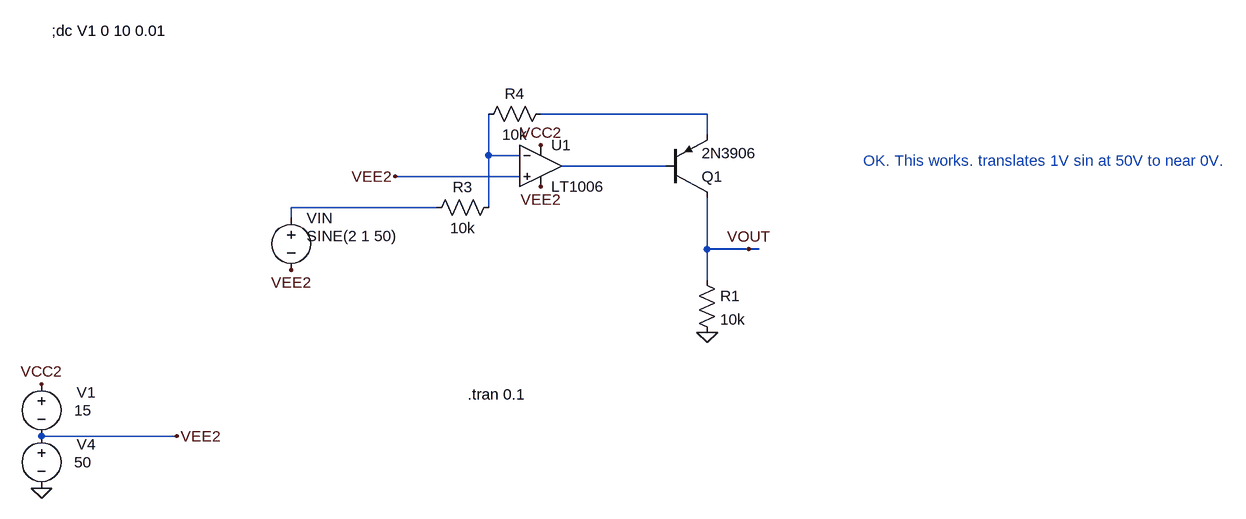
[diagram p0: schematic Draft14.asc]
Draft14.asc, the LTspice schematic file:
Version 4
SHEET 1 1536 680
WIRE 672 16 416 16
WIRE 672 48 672 16
WIRE 336 80 336 16
WIRE 384 80 336 80
WIRE 608 96 448 96
WIRE 384 112 192 112
WIRE 256 160 32 160
WIRE 336 160 336 80
WIRE 32 176 32 160
WIRE 672 224 672 144
WIRE 736 224 672 224
WIRE 752 224 736 224
WIRE 672 272 672 224
WIRE -144 512 -352 512
FLAG -352 592 0
FLAG -144 512 VEE2
FLAG -352 432 VCC2
FLAG 672 352 0
FLAG 416 128 VEE2
FLAG 416 64 VCC2
FLAG 32 256 VEE2
FLAG 192 112 VEE2
FLAG 736 224 VOUT
SYMBOL voltage 32 160 R0
WINDOW 123 0 0 Left 0
WINDOW 39 0 0 Left 0
WINDOW 3 24 44 Left 2
SYMATTR Value SINE(2 1 50)
SYMATTR InstName VIN
SYMBOL voltage -352 496 R0
WINDOW 0 54 29 Left 2
WINDOW 3 50 56 Left 2
WINDOW 123 0 0 Left 0
WINDOW 39 0 0 Left 0
SYMATTR InstName V4
SYMATTR Value 50
SYMBOL pnp 608 144 M180
SYMATTR InstName Q1
SYMATTR Value 2N3906
SYMBOL voltage -352 416 R0
WINDOW 0 54 29 Left 2
WINDOW 3 50 56 Left 2
WINDOW 123 0 0 Left 0
WINDOW 39 0 0 Left 0
SYMATTR InstName V1
SYMATTR Value 15
SYMBOL res 656 256 R0
SYMATTR InstName R1
SYMATTR Value 10k
SYMBOL OpAmps\\LT1006 416 32 R0
SYMATTR InstName U1
SYMBOL res 352 144 R90
WINDOW 0 0 56 VBottom 2
WINDOW 3 32 56 VTop 2
SYMATTR InstName R3
SYMATTR Value 10k
SYMBOL res 432 0 R90
WINDOW 0 0 56 VBottom 2
WINDOW 3 32 56 VTop 2
SYMATTR InstName R4
SYMATTR Value 10k
TEXT -336 -112 Left 2 !;dc V1 0 10 0.01
TEXT 304 448 Left 2 !.tran 0.1
TEXT 912 88 Left 2 ;OK. This works. translates 1V sin at 50V to near 0V.

The netlist it stands for:
* Draft14.asc
VIN N004 VEE2 SINE(2 1 50)
V4 VEE2 0 50
Q1 VOUT N003 N001 0 2N3906
V1 VCC2 VEE2 15
R1 VOUT 0 10k
XU1 VEE2 N002 VCC2 VEE2 N003 LT1006  ; pins In+ In- V+ V- OUT
R3 N002 N004 10k
R4 N001 N002 10k
.model NPN NPN
.model PNP PNP
.lib standard.bjt
;dc V1 0 10 0.01
.tran 0.1
* OK. This works. translates 1V sin at 50V to near 0V.
.lib LTC.lib
.backanno
.end